# EAGLE design satshakit_cnc_usb_hat (EAGLE 9.1.0)
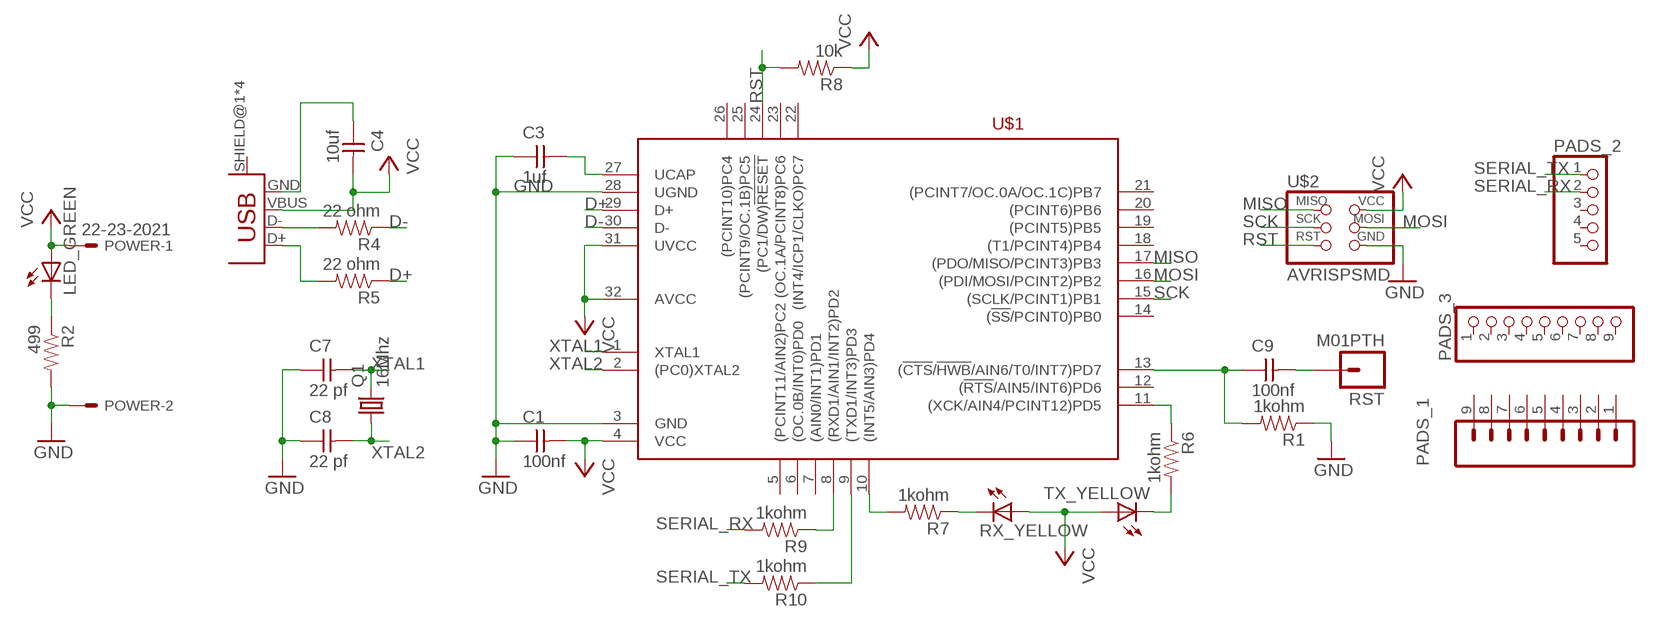
[diagram p0: schematic, sheet 1]

## Parts
C1  100nf  CAP-UNPOLARIZEDFAB  [C1206FAB]
C3  1uf  CAP-UNPOLARIZEDFAB  [C1206FAB]
C4  10uf  CAP-UNPOLARIZEDFAB  [C1206FAB]
C7  22 pf  CAP-UNPOLARIZEDFAB  [C1206FAB]
C8  22 pf  CAP-UNPOLARIZEDFAB  [C1206FAB]
C9  100nf  CAP-UNPOLARIZEDFAB  [C1206FAB]
LED_GREEN  LED1206  [1206]
PADS_1  M09LONGPADS  [1X09_LONGPADS]
PADS_2  PINHD-1X5  [1X05]
PADS_3  PINHD-1X9  [1X09]
POWER  22-23-2021  [22-23-2021]
Q1  16Mhz  CSM-7X-DU  [CSM-7X-DU]
R1  1kohm  RESISTOR1206  [1206]
R2  499  RESISTOR1206  [1206]
R4  22 ohm  RESISTOR1206  [1206]
R5  22 ohm  RESISTOR1206  [1206]
R6  1kohm  RESISTOR1206  [1206]
R7  1kohm  RESISTOR1206  [1206]
R8  10k  RESISTOR1206  [1206]
R9  1kohm  RESISTOR1206  [1206]
R10  1kohm  RESISTOR1206  [1206]
RST  M01PTH  [1X01]
RX_YELLOW  LED1206  [1206]
TX_YELLOW  LED1206  [1206]
U$1  ATMEGA16U2-TQ  [TQFP32-08THIN]
U$2  AVRISPSMD  [2X03SMD]
U$3  USB_MINIB  [USB_MINIB]

## Nets
D+: R5.1 U$1.29(D+)
D-: R4.1 U$1.30(D-)
DTR: C9.1 R1.2 U$1.13((!CTS!/!HWB!/AIN6/T0/INT7)PD7)
GND: C1.1 C3.1 C4.1 C7.1 C8.1 POWER.2 R1.1 R2.2 U$1.3(GND) U$1.28(UGND) U$2.6(GND) U$3.GND
MISO: U$1.17((PDO/MISO/PCINT3)PB3) U$2.1(MISO)
MOSI: U$1.16((PDI/MOSI/PCINT2)PB2) U$2.4(MOSI)
N$1: R6.2 TX_YELLOW.2(C)
N$2: R6.1 U$1.11((XCK/AIN4/PCINT12)PD5)
N$4: R4.2 U$3.D-
N$5: R5.2 U$3.D+
N$6: C3.2 U$1.27(UCAP)
N$7: R7.2 U$1.10((INT5/AIN3)PD4)
N$8: C9.2 RST.1
N$9: R9.1 U$1.8((RXD1/AIN1/INT2)PD2)
N$10: R7.1 RX_YELLOW.2(C)
N$11: R10.1 U$1.9((TXD1/INT3)PD3)
N$26: LED_GREEN.2(C) R2.1
RST: R8.2 U$1.24((PC1/DW)!RESET) U$2.5(RST)
SCK: U$1.15((SCLK/PCINT1)PB1) U$2.3(SCK)
SERIAL_RX: PADS_2.2 R9.2
SERIAL_TX: PADS_2.1 R10.2
VCC: C1.2 C4.2 LED_GREEN.1(A) POWER.1 R8.1 RX_YELLOW.1(A) TX_YELLOW.1(A) U$1.4(VCC) U$1.31(UVCC) U$1.32(AVCC) U$2.2(VCC) U$3.VBUS
XTAL1: C7.2 Q1.2 U$1.1(XTAL1)
XTAL2: C8.2 Q1.1 U$1.2((PC0)XTAL2)
Unconnected: PADS_1.1 PADS_1.2 PADS_1.3 PADS_1.4 PADS_1.5 PADS_1.6 PADS_1.7 PADS_1.8 PADS_1.9 PADS_2.3 PADS_2.4 PADS_2.5 PADS_3.1 PADS_3.2 PADS_3.3 PADS_3.4 PADS_3.5 PADS_3.6 PADS_3.7 PADS_3.8 PADS_3.9 U$1.5((PCINT11/AIN2)PC2) U$1.6((OC.0B/INT0)PD0) U$1.7((AIN0/INT1)PD1) U$1.12((!RTS!/AIN5/INT6)PD6) U$1.14((!SS!/PCINT0)PB0) U$1.18((T1/PCINT4)PB4) U$1.19((PCINT5)PB5) U$1.20((PCINT6)PB6) U$1.21((PCINT7/OC.0A/OC.1C)PB7) U$1.22((INT4/ICP1/CLKO)PC7) U$1.23((OC.1A/PCINT8)PC6) U$1.25((PCINT9/OC.1B)PC5) U$1.26((PCINT10)PC4) U$3.SHIELD@1(SHIELD) U$3.SHIELD@2(SHIELD) U$3.SHIELD@3(SHIELD) U$3.SHIELD@4(SHIELD)

## Library data of the parts
C1 C3 C4 C7-C9 = fab:CAP-UNPOLARIZED
LED_GREEN RX_YELLOW TX_YELLOW = 01_FAB_Hello:LED
PADS_1 = 01_SparkFun:M09: Header 9 Standard 9-pin 0.1" header. Use with straight break away headers (SKU : PRT-00116), right angle break away headers (PRT-00553), swiss pins (PRT-00743), machine pins (PRT-00117), and female headers (PRT-00115).
PADS_2 = pinhead:PINHD-1X5: PIN HEADER
PADS_3 = pinhead:PINHD-1X9: PIN HEADER
POWER = con-molex:22-23-2021: .100" (2.54mm) Center Header - 2 Pin; MF: MOLEX; MPN: 22-23-2021; OC_FARNELL: 1462926; OC_NEWARK: 25C3832
Q1 = crystal:CSM-7X-DU: SMD CRYSTAL Source: www.ecsxtal.com .. Crystal 3.6864MHz CSM_7X_DU.PDF; OC_FARNELL: unknown; OC_NEWARK: unknown
R1 R2 R4-R10 = 01_SparkFun:RESISTOR: Resistor Basic schematic elements and footprints for 0603, 1206, and PTH 1/10th watt (small) resistors.
RST = 01_SparkFun:M01: Header 1 Standard 1-pin 0.1" header. Use with straight break away headers (SKU : PRT-00116), right angle break away headers (PRT-00553), swiss pins (PRT-00743), machine pins (PRT-00117), and female headers (PRT-00115).
U$1 = fab:ATMEGA16U2
U$2 = fab:AVRISP
U$3 = fab:USB_MINIB

## Board
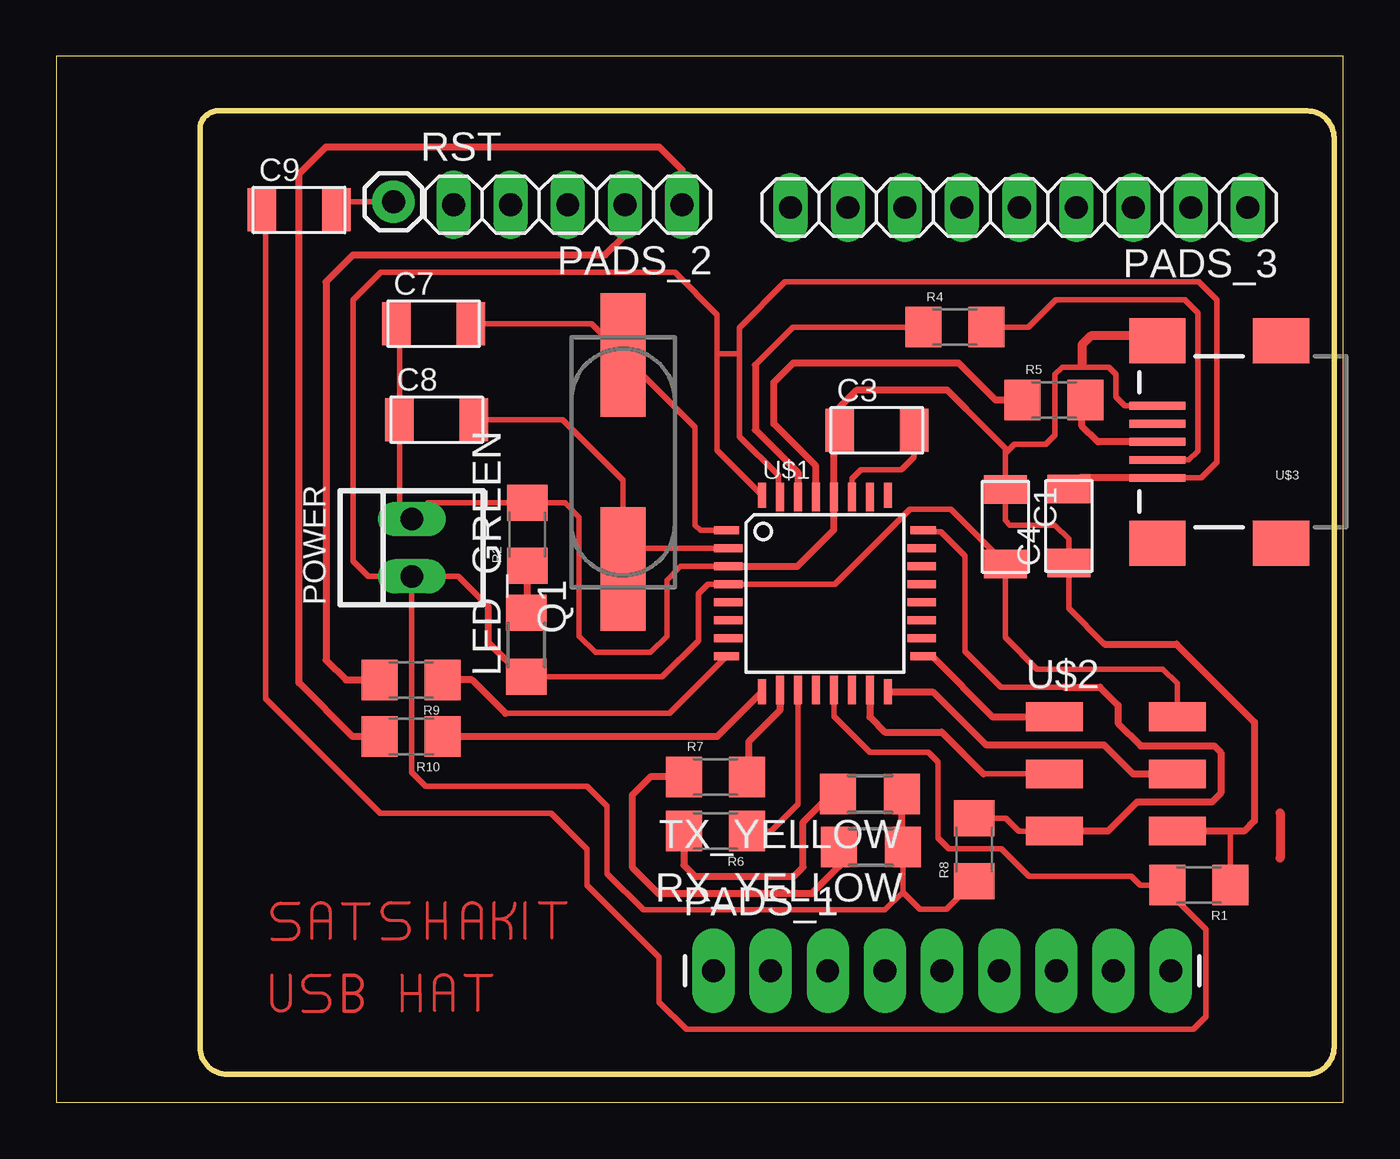
[diagram p1: board, top side]

Size 57.2 x 46.47 mm. Coordinates in mm from the lower left corner, seen from the top.
Outline: 0,0 57.2,0 57.2,46.47 0,46.47 0,0
Copper layers (1*16): Top 0.035mm / dielectric 1.5mm / Bottom 0.035mm
Design rules "default *": minimum track width 10mil, minimum drill 24mil, track to track 0.43mm, track to pad 0.43mm, pad to pad 0.43mm, via to via 0.43mm, smd to smd 0.4mm, copper to edge 0.4mm, drill to drill 0.4mm, minimum pad ring 10mil, minimum via ring 8mil, stop-mask expansion 4mil, vias tented up to drill 0mil, thermal gap 10mil
Milling: area 6.4,1.2 to 56.8,44

### Footprints (pad centres in the part's own frame; a part is rotated, then mirrored left to right if it is on the bottom)
C1206FAB = smd 1.27 x 1.905: 1 -1.651,0; 2 1.651,0
1206 = smd 1.6 x 1.803: 1 -1.422,0; 2 1.422,0
1X09_LONGPADS = drill 1.016 pad 1.88 long: 1 0,0; 2 2.54,0; 3 5.08,0; 4 7.62,0; 5 10.16,0; 6 12.7,0; 7 15.24,0; 8 17.78,0; 9 20.32,0
1X05 = drill 1.016 long: 1 -5.08,0; 2 -2.54,0; 3 0,0; 4 2.54,0; 5 5.08,0
1X09 = drill 1.016 long: 1 -10.16,0; 2 -7.62,0; 3 -5.08,0; 4 -2.54,0; 5 0,0; 6 2.54,0; 7 5.08,0; 8 7.62,0; 9 10.16,0
22-23-2021 = drill 1 long: 1 -1.27,0; 2 1.27,0
CSM-7X-DU = smd 5.5 x 2: 1 -4.75,0; 2 4.75,0
1206' = smd 1.6 x 1.8: 1 -1.4,0; 2 1.4,0
1X01 = drill 1.016 pad 1.88: 1 0,0
TQFP32-08THIN = smd 1.118 x 0.356: 1 -4.369,2.8; 8 -4.369,-2.8; 17 4.369,-2.8; 24 4.369,2.8 | smd 1.27 x 0.356: 2 -4.293,2; 3 -4.293,1.2; 4 -4.293,0.4; 5 -4.293,-0.4; 6 -4.293,-1.2; 7 -4.293,-2; 18 4.293,-2; 19 4.293,-1.2; 20 4.293,-0.4; 21 4.293,0.4; 22 4.293,1.2; 23 4.293,2 | smd 0.356 x 1.118: 9 -2.8,-4.369; 16 2.8,-4.369; 25 2.8,4.369; 32 -2.8,4.369 | smd 0.356 x 1.27: 10 -2,-4.293; 14 1.2,-4.293; 15 2,-4.293; 26 2,4.293; 27 1.2,4.293; 31 -2,4.293 | smd 0.35 x 1.27: 11 -1.2,-4.293; 12 -0.4,-4.293; 13 0.4,-4.293; 28 0.4,4.293; 29 -0.4,4.293; 30 -1.2,4.293
2X03SMD = smd 2.54 x 1.27: 1 -2.54,2.54; 2 2.92,2.54; 3 -2.54,0; 4 2.92,0; 5 -2.54,-2.54; 6 2.92,-2.54
USB_MINIB = smd 2.5 x 0.35: D+ 3.77,0; D- 3.77,0.8; GND 3.77,-1.6; ID 3.77,-0.8; VBUS 3.77,1.6 | smd 2.5 x 2: SHIELD@1 -1.73,-4.5; SHIELD@2 -1.73,4.5; SHIELD@3 3.77,4.5; SHIELD@4 3.77,-4.5

### Placement (x,y rotation side)
C1  42.18,25.57 270 top
C3  36.47,29.85 0 top
C4  45,25.6 90 top
C7  16.77,34.59 0 top
C8  16.91,30.33 0 top
C9  10.79,39.65 0 top
LED_GREEN  20.9,20.32 90 top
PADS_1  29.21,5.84 0 top
PADS_2  22.73,39.88 180 top
PADS_3  42.8,39.75 180 top
POWER  15.8,24.64 90 top
Q1  25.19,28.45 90 top
R1  1kohm  [1206']  50.79,9.64 180 top
R2  499  [1206']  20.93,25.23 90 top
R4  22 ohm  [1206']  39.94,34.44 0 top
R5  22 ohm  [1206']  44.34,31.21 0 top
R6  1kohm  [1206']  29.3,12.04 180 top
R7  1kohm  [1206']  29.3,14.46 0 top
R8  499  [1206']  40.8,11.22 90 top
R9  1kohm  [1206']  15.77,18.76 180 top
R10  1kohm  [1206']  15.77,16.25 180 top
RST  14.99,40.01 0 top
RX_YELLOW  36.21,11.33 180 top
TX_YELLOW  36.17,13.7 180 top
U$1  34.16,22.61 0 top
U$2  46.91,14.59 0 top
U$3  52.7,29.34 180 top

### Tracks (layer width: path | path; a pad name or v marks a point on that pad's centre or on a via)
D+
  Top 0.305: U$1.29 33.76,28.27 31.9,30.14 31.9,31.98 32.77,32.85 40.1,32.85 41.74,31.21 R5.1
D-
  Top 0.254: R4.1 32.75,34.44 31.08,32.76
  Top 0.305: 31.08,32.76 31.08,29.87 32.96,27.98 U$1.30
DTR
  Top 0.254: U$1.13 34.56,17.16 36.17,15.55 38.77,15.55 39.19,15.13 39.19,11.75 39.67,11.26 42.01,11.26 43.23,10.04 47.79,10.04 48.19,9.64 R1.2 49.29,9.75 49.29,9.49 51.1,7.69 51.1,3.8 50.54,3.24 28,3.24 26.79,4.45 26.79,6.45 23.59,9.64 23.59,11.25 21.99,12.85 14.39,12.85 9.31,17.92 9.31,18.44 9.31,18.84 9.31,39.47 C9.1
GND
  Top 0.254: R1.1 52.19,12.05 | 46.59,20.36 45,21.95 C4.1 45,25.04 44.39,25.64 42.39,25.64 42.18,25.86 C1.1 42.18,28.84 | 40.43,30.81 42.18,29.05 42.18,28.84 | 42.18,28.84 42.58,29.25 43.99,29.25 44.39,29.64 44.39,30.07 44.39,30.08 44.39,32.34 44.71,32.66 46.77,32.66 47.1,32.34 47.1,31.34 47.5,30.94 U$3.GND | U$1.3 27.75,23.81 27.15,23.2 27.15,20.71 26.42,19.99 23.96,19.99 23.23,20.71 23.23,26 22.61,26.63 R2.2 16.52,26.63 POWER.2 15.26,26.45 C8.1 15.26,34.45 C7.1
  Top 0.305: 46.59,20.36 49.79,20.36 53.25,16.89 53.25,12.5 52.79,12.05 52.19,12.05 U$2.6 | U$1.3 32.94,23.81 34.56,25.43 U$1.28 34.56,29.6 C3.1 34.82,30.87 35.59,31.64 39.59,31.64 40.43,30.81
MISO
  Top 0.305: U$2.1 41.61,17.13 38.93,19.81 U$1.17
MOSI
  Top 0.305: U$1.16 38.96,18.24 41.33,15.87 46.56,15.87 47.85,14.59 U$2.4
N$1
  Top 0.305: R6.2 27.9,10.54 28.39,10.04 32.79,10.04 33.19,10.45 33.19,12.45 34.45,13.7 TX_YELLOW.2
N$2
  Top 0.254: R6.1 31.76,12.04 32.96,13.25 U$1.11
N$3
  Top 0.406: 54.39,12.85 54.39,10.85
N$4
  Top 0.254: R4.2 43.21,34.44 44.42,35.65 46.69,35.65 46.69,35.64 50.16,35.64 50.74,35.07 50.74,28.93 50.35,28.54 U$3.D-
N$5
  Top 0.305: U$3.D+ 46.3,29.34 45.59,30.05 45.59,31.46 R5.2
N$6
  Top 0.254: U$1.27 35.36,27.7 35.75,28.09 37.56,28.09 38.12,28.65 C3.2
N$7
  Top 0.305: U$1.10 32.16,17.42 30.79,16.05 30.79,14.55 R7.2
N$8
  Top 0.254: RST.1 12.8,40.01 C9.2
N$9
  Top 0.254: 19.96,17.28 27.27,17.28 U$1.8
  Top 0.305: R9.1 18.47,18.76 19.96,17.28
N$10
  Top 0.305: R7.1 26.4,14.46 25.59,13.64 25.59,10.45 26.75,9.29 33.59,9.29 34.79,10.48 RX_YELLOW.2
N$11
  Top 0.305: U$1.9 29.37,16.25 R10.1
N$12
  Top 0.406: 48.79,34.05 45.99,34.05 45.59,33.64 45.59,32.84
N$13
  Top 0.127: 9.59,7.25 10.39,7.25 arc90 10.79,7.65 arc90 10.39,8.04 9.99,8.04 arc-90 9.59,8.45 arc-90 9.99,8.85 10.79,8.85
N$14
  Top 0.127: 11.37,7.27 11.37,8.07 | 11.37,8.07 11.37,8.47 arc-90 11.77,8.87 arc-90 12.17,8.47 12.17,8.07 | 12.17,8.07 12.17,7.27 | 11.37,8.07 12.17,8.07
N$15
  Top 0.127: 12.72,8.82 13.27,8.82 | 13.27,8.82 13.92,8.82 | 13.27,8.82 13.27,7.25
N$16
  Top 0.127: 14.49,7.27 15.29,7.27 arc90 15.69,7.67 arc90 15.29,8.07 14.89,8.07 arc-90 14.49,8.47 arc-90 14.89,8.87 15.69,8.87
N$17
  Top 0.127: 16.49,8.87 16.49,8.07 | 16.49,8.07 16.49,7.27 | 16.49,8.07 17.29,8.07 | 17.29,8.07 17.29,8.87 | 17.29,8.07 17.29,7.27
N$18
  Top 0.127: 18.09,7.27 18.09,8.07 | 18.09,8.07 18.09,8.47 arc-90 18.49,8.87 arc-90 18.89,8.47 18.89,8.07 | 18.89,8.07 18.89,7.27 | 18.09,8.07 18.89,8.07
N$19
  Top 0.127: 19.47,7.27 19.47,8.14 | 19.47,8.14 19.47,8.87 | 20.84,7.27 20.84,8.87 | 19.47,8.14 19.69,8.14 arc90 20.39,8.85
N$20
  Top 0.127: 19.74,8.14 arc-90 20.19,7.7 20.19,7.27
N$22
  Top 0.127: 21.47,8.87 22.02,8.87 | 22.02,8.87 22.67,8.87 | 22.02,8.87 22.02,7.29
N$23
  Top 0.127: 18.17,5.65 18.72,5.65 | 18.72,5.65 19.37,5.65 | 18.72,5.65 18.72,4.07
N$24
  Top 0.127: 15.37,5.65 15.37,4.85 | 15.37,4.85 15.37,4.04 | 15.37,4.85 16.17,4.85 | 16.17,4.85 16.17,5.65 | 16.17,4.85 16.17,4.04
N$25
  Top 0.127: 16.82,4.07 16.82,4.87 | 16.82,4.87 16.82,5.27 arc-90 17.22,5.67 arc-90 17.62,5.27 17.62,4.87 | 17.62,4.87 17.62,4.07 | 16.82,4.87 17.62,4.87
N$26
  Top 0.305: R2.1 20.93,21.77 LED_GREEN.2
N$27
  Top 0.127: 10.97,4.04 11.77,4.04 arc90 12.17,4.45 arc90 11.77,4.85 11.37,4.85 arc-90 10.97,5.25 arc-90 11.37,5.65 12.17,5.65
N$28
  Top 0.152: 12.79,4.85 12.79,5.65 13.19,5.65 arc-90 13.59,5.25 arc-90 13.19,4.85 | 12.79,4.85 12.79,4.04 13.19,4.04 arc90 13.59,4.45 arc90 13.19,4.85 | 12.79,4.85 13.19,4.85
N$30
  Top 0.127: 10.39,5.65 10.39,4.45 arc-90 9.99,4.04 arc-90 9.59,4.45 9.59,5.65
RST
  Top 0.254: R8.2 42.22,12.62 42.79,12.04 44.79,12.04 44.79,12.05 | U$1.24 38.6,25.34 39.32,25.34 40.39,24.27 40.39,20.05 41.99,18.45 44.79,18.45
  Top 0.305: U$2.5 44.79,12.05 46.74,12.05 48.03,13.33 51.36,13.33 51.75,13.72 51.75,15.55 51.46,15.84 48.2,15.84 47.19,16.84 47.19,17.64 46.39,18.45 44.79,18.45
SCK
  Top 0.254: U$2.3 41.22,14.59
  Top 0.305: 41.22,14.59 39.36,16.45 36.84,16.45 36.16,17.12 U$1.15
SERIAL_RX
  Top 0.305: R9.2 12.87,18.76 11.99,19.64 11.99,36.45 13.19,37.65 24.39,37.65 25.27,38.53 PADS_2.2
SERIAL_TX
  Top 0.305: PADS_2.1 27.81,41.42 26.79,42.45 11.99,42.45 10.79,41.24 10.79,18.63 13.17,16.25 R10.2
VCC
  Top 0.254: 20.74,18.9 LED_GREEN.1 26.93,18.9 28.55,20.51 28.55,22.59 28.97,23.01 U$1.4 34.61,23.01 37.94,26.34 39.76,26.34 C1.2 42.18,20.66 43.59,19.25 49.19,19.25 49.83,18.61 U$2.2 | R8.1 39.56,8.58 38.39,8.58 37.63,9.34 | 15.77,23.34 POWER.1 | POWER.1 17.87,23.37 19.19,22.05 | U$1.32 29.38,28.96 29.38,33.25 | 29.38,33.25 29.38,34.99 27.5,36.87 14.42,36.87 13.19,35.64 13.19,24.05 13.87,23.37 POWER.1 | U$3.VBUS 50.88,27.74 51.59,28.45 51.59,35.64 50.79,36.45 32.39,36.45 30.37,34.42 30.37,33.25 | 30.37,33.25 30.37,29.58 32.1,27.85 32.1,26.96 U$1.31 | 29.38,33.25 30.37,33.25 | 37.59,11.37 RX_YELLOW.1 37.63,9.34 | POWER.1 15.8,14.65 16.41,14.04 23.59,14.04 24.48,13.15 24.48,10.15 26.09,8.54 36.84,8.54 37.63,9.34
  Top 0.305: 37.59,11.37 TX_YELLOW.1 | 19.19,22.05 19.19,20.45 20.74,18.9 | U$3.VBUS 45.49,27.74 C4.2
XTAL1
  Top 0.254: U$1.1 28.63,25.41 28.39,25.64 28.39,30 Q1.2 23.8,34.59 C7.2
XTAL2
  Top 0.254: U$1.2 25.35,24.61 25.19,24.45 Q1.1 25.19,27.64 22.51,30.33 C8.2